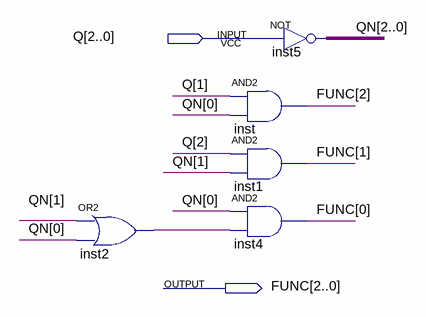
[diagram p0: schematic sheet]
// Quartus schematic FUNC.bdf as structural Verilog: 5 symbols, 2 pins
module FUNC (
  input  [2:0] Q,
  output [2:0] FUNC
);

  wire inst2_out;
  wire [2:0] QN;

  or inst2 (inst2_out, QN[1], QN[0]);
  and inst (FUNC[2], Q[1], QN[0]);
  and inst1 (FUNC[1], Q[2], QN[1]);
  and inst4 (FUNC[0], QN[0], inst2_out);
  assign QN = ~Q;  // NOT inst5, 3 bits wide
endmodule
